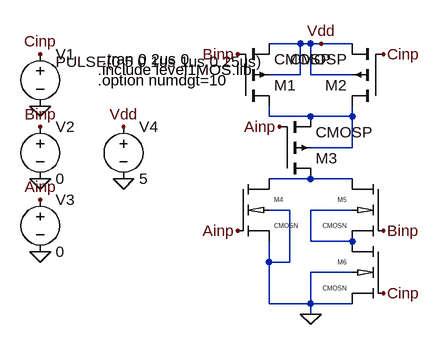
[diagram p0: schematic AOI.asc]
AOI.asc, the LTspice schematic file:
Version 4
SHEET 1 880 680
WIRE 208 64 160 64
WIRE 224 64 208 64
WIRE 240 64 224 64
WIRE 288 64 240 64
WIRE 208 112 208 64
WIRE 208 112 160 112
WIRE 224 112 224 64
WIRE 288 112 224 112
WIRE 160 176 160 160
WIRE 224 176 160 176
WIRE 288 176 288 160
WIRE 288 176 224 176
WIRE 288 224 288 176
WIRE 288 224 224 224
WIRE 224 272 160 272
WIRE 288 272 224 272
WIRE 192 320 160 320
WIRE 288 320 224 320
WIRE 224 368 224 320
WIRE 288 368 224 368
WIRE 160 400 160 368
WIRE 192 400 192 320
WIRE 192 400 160 400
WIRE 288 416 224 416
WIRE 160 464 160 400
WIRE 224 464 224 416
WIRE 224 464 160 464
WIRE 288 464 224 464
WIRE 224 480 224 464
FLAG 112 352 Ainp
FLAG 176 192 Ainp
FLAG 336 352 Binp
FLAG 112 80 Binp
FLAG 336 80 Cinp
FLAG 336 448 Cinp
FLAG -192 192 Binp
FLAG -192 160 0
FLAG -192 272 0
FLAG -192 384 0
FLAG -64 272 0
FLAG -64 192 Vdd
FLAG 240 64 Vdd
FLAG 224 480 0
FLAG -192 304 Ainp
FLAG -192 80 Cinp
SYMBOL cmosp 112 160 M180
SYMATTR InstName M1
SYMATTR Value2 l=0.36u w=0.72u
SYMBOL cmosp 336 160 R180
SYMATTR InstName M2
SYMATTR Value2 l=0.36u w=0.72u
SYMBOL cmosp 176 272 M180
SYMATTR InstName M3
SYMATTR Value2 l=0.36u w=1.44u
SYMBOL cmosn 112 272 R0
SYMATTR InstName M4
SYMATTR Value2 l=0.72u w=0.36u
SYMBOL cmosn 336 272 M0
SYMATTR InstName M5
SYMATTR Value2 l=0.36u w=0.36u
SYMBOL cmosn 336 368 M0
SYMATTR InstName M6
SYMATTR Value2 l=0.36u w=0.36u
SYMBOL voltage -192 64 R0
WINDOW 123 0 0 Left 2
WINDOW 39 0 0 Left 2
WINDOW 3 24 28 Left 2
SYMATTR InstName V1
SYMATTR Value PULSE(0 5 0 1us 1us 0.25us)
SYMBOL voltage -192 176 R0
WINDOW 123 0 0 Left 2
WINDOW 39 0 0 Left 2
SYMATTR InstName V2
SYMATTR Value 0
SYMBOL voltage -192 288 R0
WINDOW 123 0 0 Left 2
WINDOW 39 0 0 Left 2
SYMATTR InstName V3
SYMATTR Value 0
SYMBOL voltage -64 176 R0
WINDOW 123 0 0 Left 2
WINDOW 39 0 0 Left 2
SYMATTR InstName V4
SYMATTR Value 5
TEXT -104 104 Left 2 !.include level1MOS.lib
TEXT -104 120 Left 2 !.option numdgt=10
TEXT -96 88 Left 2 !.tran 0 2us 0

The netlist it stands for:
* AOI.asc
M1 N001 Binp Vdd Vdd CMOSP l=0.36u w=0.72u
M2 N001 Cinp Vdd Vdd CMOSP l=0.36u w=0.72u
M3 N002 Ainp N001 N001 CMOSP l=0.36u w=1.44u
M4 N002 Ainp 0 0 CMOSN l=0.72u w=0.36u
M5 N002 Binp N003 N003 CMOSN l=0.36u w=0.36u
M6 N003 Cinp 0 0 CMOSN l=0.36u w=0.36u
V1 Cinp 0 PULSE(0 5 0 1us 1us 0.25us)
V2 Binp 0 0
V3 Ainp 0 0
V4 Vdd 0 5
.model NMOS NMOS
.model PMOS PMOS
.lib standard.mos
.include level1MOS.lib
.option numdgt=10
.tran 0 2us 0
.lib tsmc018.lib
.backanno
.end